# EAGLE design BLE -- HM-10 -- Breakout v0.9.9 (EAGLE 6.5.0)
HM-10 Breakout
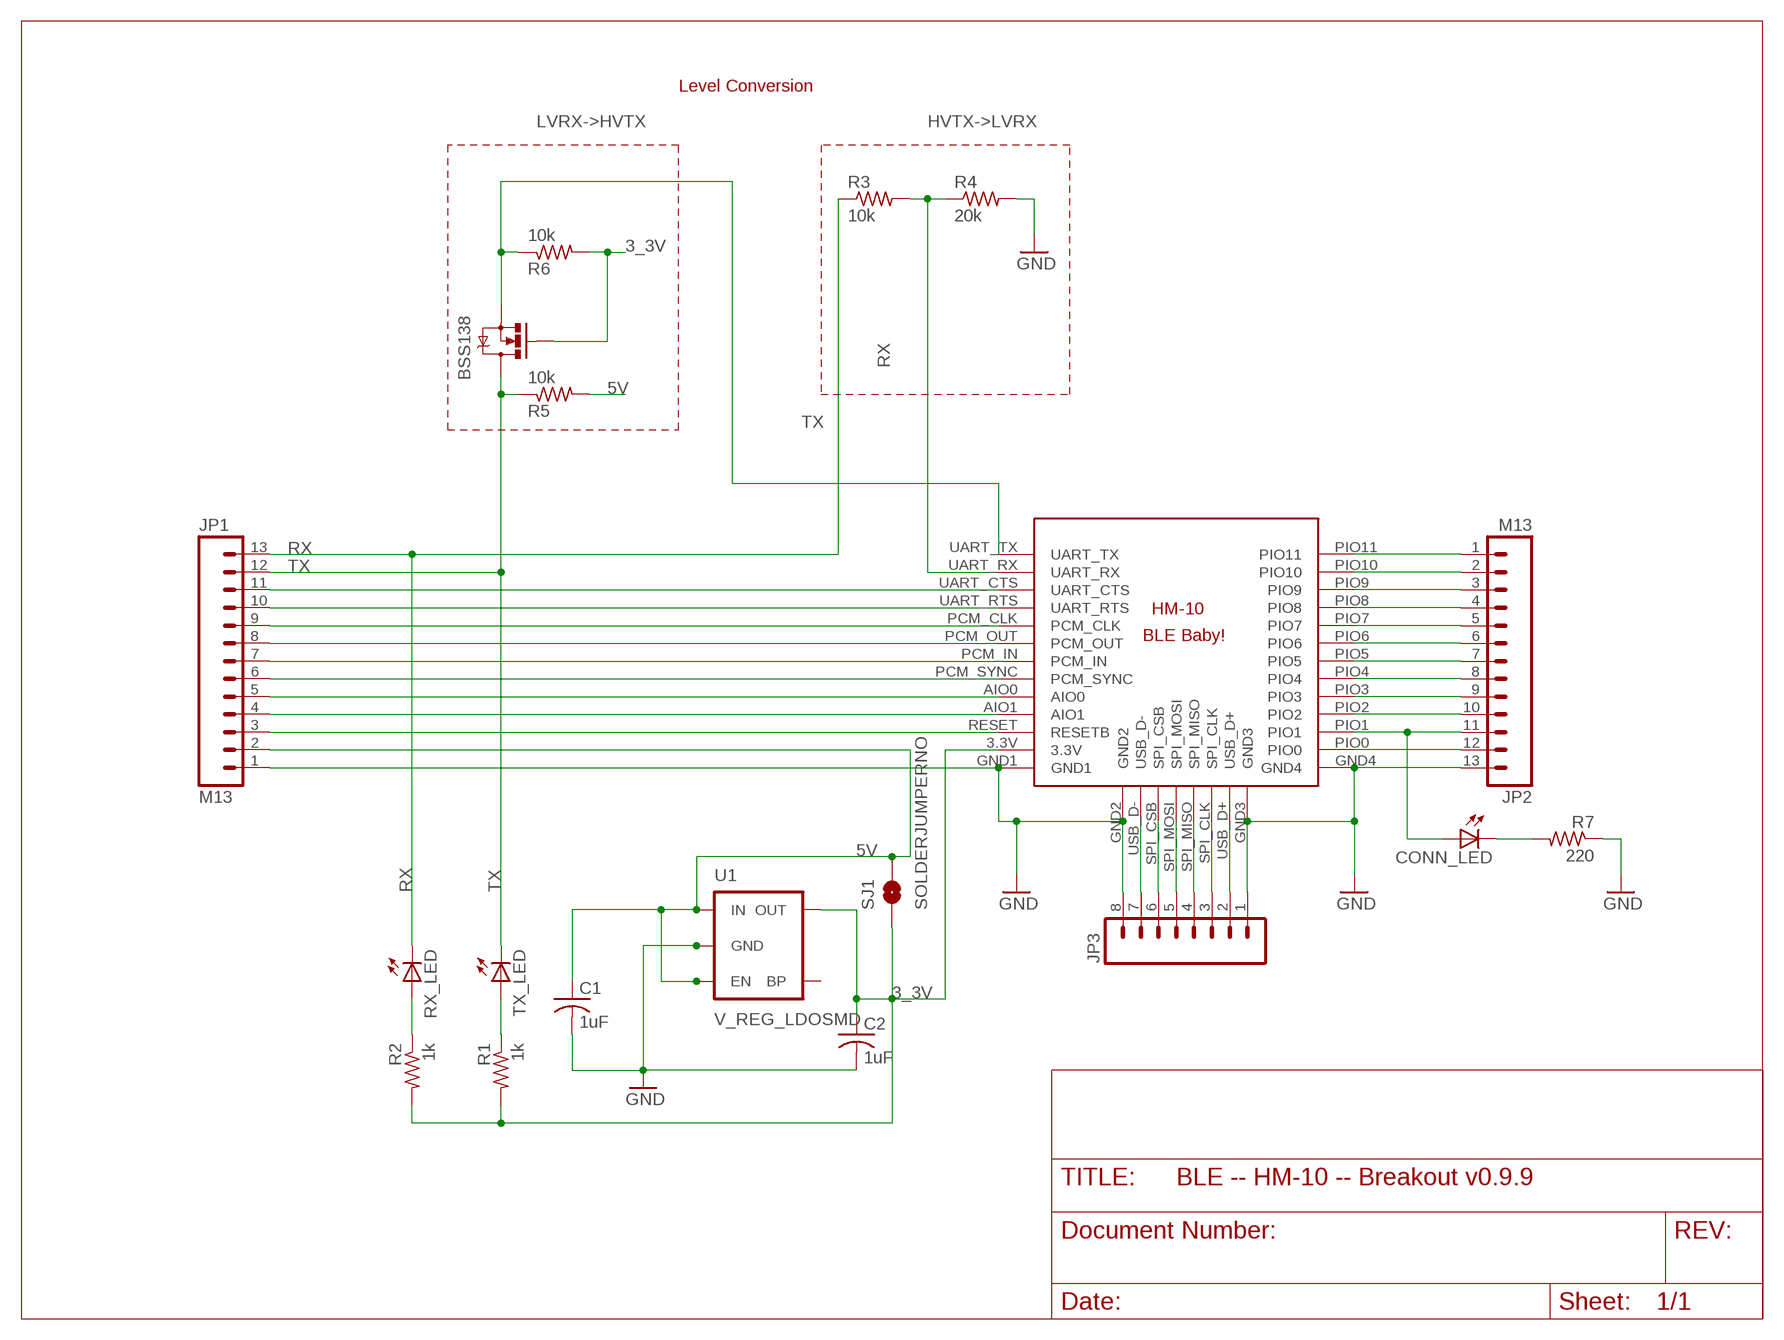
[diagram p0: schematic, sheet 1]

## Parts
BSS138  MOSFET-NCHANNELSMD  [SOT23-3]
C1  1uF  C-USC0805K  [C0805K]
C2  1uF  C-USC0805K  [C0805K]
CONN_LED  LED0603  [LED-0603]
JP1  M13  [1X13]
JP2  M13  [1X13]
JP3  M081X08  [1X08]
R1  1k  R-US_M0805  [M0805]
R2  1k  R-US_M0805  [M0805]
R3  10k  R-US_M0805  [M0805]
R4  20k  R-US_M0805  [M0805]
R5  10k  R-US_M0805  [M0805]
R6  10k  R-US_M0805  [M0805]
R7  220  R-US_M0805  [M0805]
RX_LED  LED0603  [LED-0603]
SJ1  SOLDERJUMPERNO  [SJ_2S-NO]
TX_LED  LED0603  [LED-0603]
U1  V_REG_LDOSMD  [SOT23-5]
U$1  BLE-HM-10  [BLE-HM-10]

## Nets
3_3V: BSS138.1(G) C2.1 R1.2 R2.2 R6.2 SJ1.1 U1.5(OUT) U$1.3.3V
5V: C1.1 JP1.2 R5.2 SJ1.2 U1.1(IN) U1.3(EN)
GND: C1.2 C2.2 JP1.1 JP2.13 JP3.1 JP3.8 R4.2 R7.1 U1.2(GND) U$1.GND1 U$1.GND2 U$1.GND3 U$1.GND4
HVTX->LVRX: R3.2 R4.1 U$1.UART_RX
LVRX->HVTX: BSS138.2(S) R6.1 U$1.UART_TX
N$2: CONN_LED.A JP2.11 U$1.PIO1
N$3: JP1.3 U$1.RESET(RESETB)
N$4: JP1.4 U$1.AIO1
N$5: JP1.5 U$1.AIO0
N$6: JP1.6 U$1.PCM_SYNC
N$7: JP1.7 U$1.PCM_IN
N$8: JP1.8 U$1.PCM_OUT
N$9: JP1.9 U$1.PCM_CLK
N$10: JP1.10 U$1.UART_RTS
N$11: JP1.11 U$1.UART_CTS
N$14: JP2.1 U$1.PIO11
N$15: JP2.2 U$1.PIO10
N$16: JP2.3 U$1.PIO9
N$17: JP2.4 U$1.PIO8
N$18: JP2.5 U$1.PIO7
N$19: JP2.6 U$1.PIO6
N$20: JP2.7 U$1.PIO5
N$21: JP2.8 U$1.PIO4
N$22: JP2.9 U$1.PIO3
N$23: JP2.10 U$1.PIO2
N$24: R1.1 TX_LED.A
N$25: JP2.12 U$1.PIO0
N$26: CONN_LED.C R7.2
N$27: R2.1 RX_LED.A
N$28: JP3.2 U$1.USB_D+
N$29: JP3.3 U$1.SPI_CLK
N$30: JP3.4 U$1.SPI_MISO
N$31: JP3.5 U$1.SPI_MOSI
N$32: JP3.6 U$1.SPI_CSB
N$33: JP3.7 U$1.USB_D-
RX: JP1.13 R3.1 RX_LED.C
TX: BSS138.3(D) JP1.12 R5.1 TX_LED.C
Unconnected: U1.4(BP)

## Notes on the sheet
- Level Conversion

## Library data of the parts
BSS138 = SparkFun:MOSFET-NCHANNEL
C1 C2 = resistor:C-US: CAPACITOR, American symbol
CONN_LED RX_LED TX_LED = SparkFun:LED: LEDs Standard schematic elements and footprints for 5mm, 3mm, 1206, and 0603 sized LEDs. 5mm - Spark Fun Electronics SKU : COM-00529 (and others)
JP1 JP2 = SparkFun:M13
JP3 = SparkFun:M08: Header 8 Standard 8-pin 0.1" header. Use with straight break away headers (SKU : PRT-00116), right angle break away headers (PRT-00553), swiss pins (PRT-00743), machine pins (PRT-00117), and female headers (PRT-00115).
R1-R7 = resistor:R-US_: RESISTOR, American symbol
SJ1 = SparkFun:SOLDERJUMPER: Solder Jumper Standard SMD solder jumper. Used to automate production. Two varients : Normally Open and Normally Closed are the same, but have different paste layers. NC will have a large amount of paste and should jumper during reflow.
U1 = SparkFun:V_REG_LDO: Voltage Regulator LDO Standard 150mA LDO voltage regulator in SOT-23 layout. Micrel part MIC5205. BP (by-pass) pin is used to lower output noise with 470pF cap.
U$1 = Random parts:BLE-HM-10

## Board
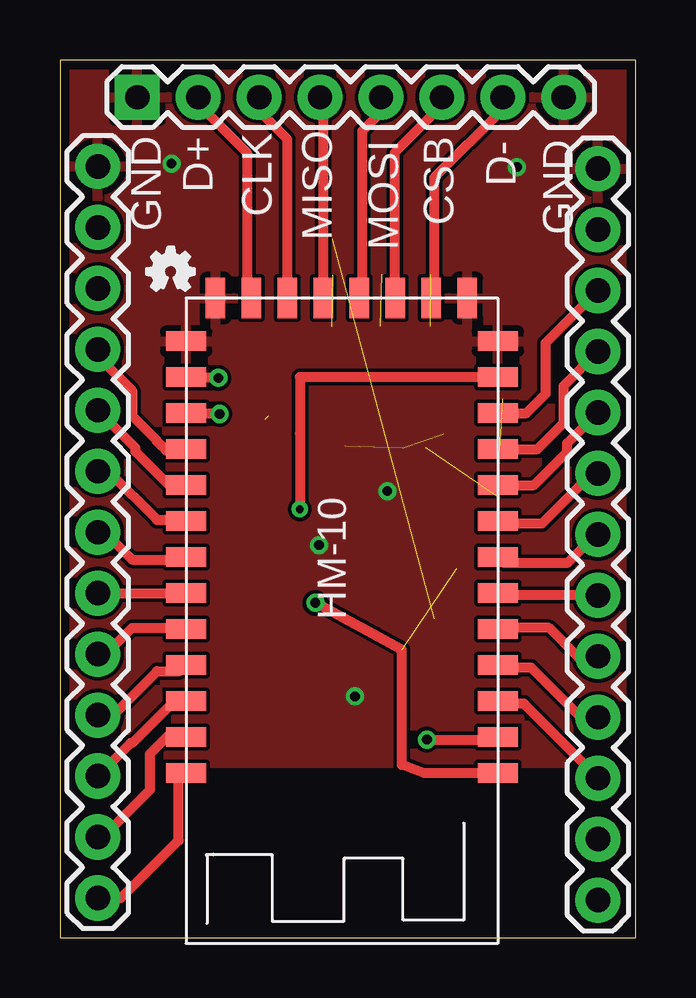
[diagram p1: board, top side]
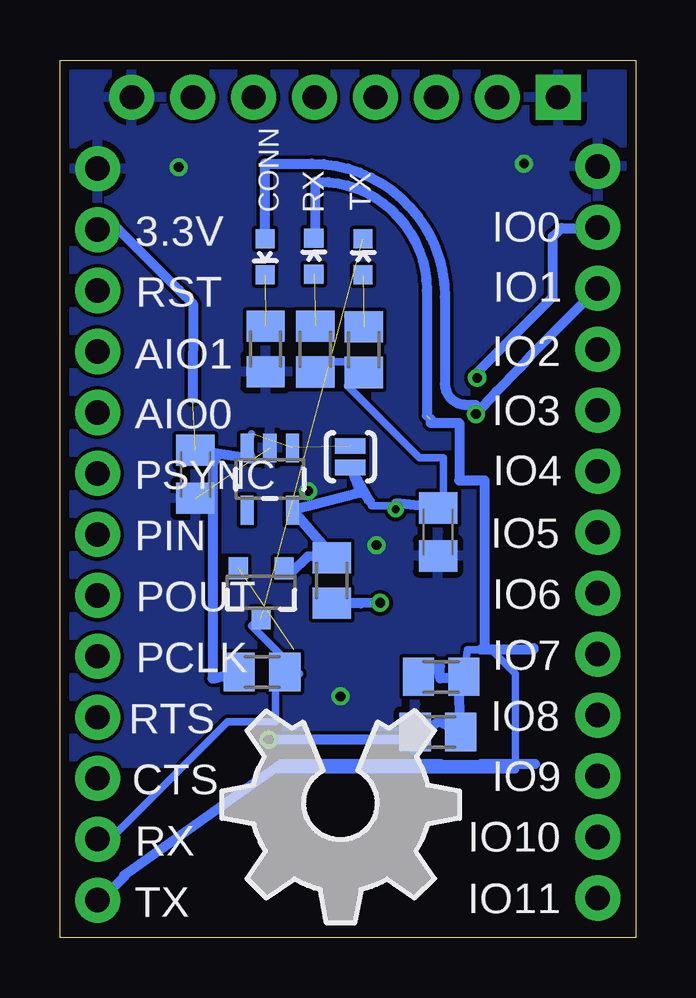
[diagram p2: board, bottom side, seen from below]

Size 24 x 36.57 mm. Coordinates in mm from the lower left corner, seen from the top.
Outline: 0,0 24,0 24,36.57 0,36.57 0,0
Copper layers (1*16): Top 0.0356mm / dielectric 1.5011mm / Bottom 0.0356mm
Design rules "LaenPCBOrder *": minimum track width 12mil, minimum drill 13mil, track to track 6mil, track to pad 6mil, pad to pad 6mil, via to via 6mil, smd to smd 6mil, copper to edge 15mil, drill to drill 6mil, minimum pad ring 7mil, minimum via ring 7mil, stop-mask expansion 4mil, vias tented up to drill 0.4mm, thermal gap 10mil

### Footprints (pad centres in the part's own frame; a part is rotated, then mirrored left to right if it is on the bottom)
SOT23-3 = smd 0.8 x 0.9: 1 -0.95,-1; 2 0.95,-1; 3 0,1.1
C0805K = smd 1.3 x 1.6: 1 -1,0; 2 1,0
LED-0603 = smd 0.8 x 0.8: A 0,-0.75; C 0,0.75
1X13 = drill 1.016 pad 1.88: 1 0,0; 2 2.54,0; 3 5.08,0; 4 7.62,0; 5 10.16,0; 6 12.7,0; 7 15.24,0; 8 17.78,0; 9 20.32,0; 10 22.86,0; 11 25.4,0; 12 27.94,0; 13 30.48,0
1X08 = drill 1.016 pad 1.88 square: 1 0,0 | drill 1.016 pad 1.88: 2 2.54,0; 3 5.08,0; 4 7.62,0; 5 10.16,0; 6 12.7,0; 7 15.24,0; 8 17.78,0
M0805 = smd 1.3 x 1.6: 1 -0.95,0; 2 0.95,0
SJ_2S-NO = smd 0.635 x 1.27: 1 -0.45,0; 2 0.45,0
SOT23-5 = smd 0.55 x 1.2: 1 -0.95,-1.3; 2 0,-1.3; 3 0.95,-1.3; 4 0.95,1.3; 5 -0.95,1.3
BLE-HM-10 = smd 1.676 x 0.813: 3.3V 0,3.29; AIO0 0,7.79; AIO1 0,6.29; GND1 0,1.79; GND4 13,1.79; PCM_CLK 0,13.79; PCM_IN 0,10.79; PCM_OUT 0,12.29; PCM_SYNC 0,9.29; PIO0 13,3.29; PIO1 13,4.79; PIO2 13,6.29; PIO3 13,7.79; PIO4 13,9.29; PIO5 13,10.79; PIO6 13,12.29; PIO7 13,13.79; PIO8 13,15.29; PIO9 13,16.79; PIO10 13,18.29; PIO11 13,19.79; RESET 0,4.79; UART_CTS 0,16.79; UART_RTS 0,15.29; UART_RX 0,18.29; UART_TX 0,19.79 | smd 0.813 x 1.676: GND2 1.27,0; GND3 11.77,0; SPI_CLK 8.77,0; SPI_CSB 4.27,0; SPI_MISO 7.27,0; SPI_MOSI 5.77,0; USB_D+ 10.27,0; USB_D- 2.77,0

### Placement (x,y rotation side)
BSS138  15.61,14.39 180 bottom
C1  18.35,19.3 270 bottom
C2  8.23,16.9 270 bottom
CONN_LED  15.44,28.37 180 bottom
JP1  22.43,32.04 270 top
JP2  1.58,1.65 90 top
JP3  3.22,35.02 0 top
R1  11.33,24.5 270 bottom
R2  13.35,24.52 270 bottom
R3  8.1,10.87 180 bottom
R4  8.24,8.57 180 bottom
R5  15.58,11.07 180 bottom
R6  12.67,14.88 90 bottom
R7  15.43,24.53 90 bottom
RX_LED  13.41,28.39 0 bottom
SJ1  11.89,20.03 90 bottom
TX_LED  11.36,28.37 0 bottom
U1  15.25,19.1 180 bottom
U$1  18.26,26.65 180 top
U$2  [OSHW_FILLX350_NOTEXT]  7.34,9.47 180 bottom
U$3  [OSHW_FILLX70_NOTEXT]  3.62,26.98 0 top

### Tracks (layer width: path | path; a pad name or v marks a point on that pad's centre or on a via)
3_3V  (via drill 0.33)
  Top 0.305: 10,21 10.04,20.98
  Top 0.406: U$1.3.3V 10,23.36 10,21 v10,17.85
  Bottom 0.305: R2.2 13,24 12,24 R1.2 12,23 9,20 8,20 8,18 C2.1 | 9.99,18.09 v10,17.85 10,18 11,18 11.09,18.19
  Bottom 0.406: C2.1 9.99,18.09 | 11.09,18.19 SJ1.1 11.47,18.53 U1.5 12.65,15.9 R6.2 13.66,15.89 14.4,15.15 14.55,15.2 BSS138.1 | R2.2 13.19,23.32
5V  (3 unrouted)
  Bottom 0.305: 16,21 U1.3 | 19,27 19.02,26.98
  Bottom 0.406: JP1.2 21.55,29.5 19.02,26.98 18.45,26.4 18.47,22.46 | U1.3 16.05,19.95 C1.1 17.5,20 17.64,19.72 17.64,10.79 R5.2
GND  (via drill 0.4)  (1 unrouted)
  other vias: 13.65,18.6 19.05,32.1 4.65,32.25 12.3,10.05 10.8,16.35
  pour Bottom: -0.51,7.27 24.64,7.27 24.64,37.34 -0.51,37.34
  pour Top: 0.5,36.5 -0.1,7.28 23.4,7.28 24,36.5
HVTX->LVRX  (via drill 0.4)
  Top 0.406: v15.3,8.25 18.15,8.25 U$1.UART_RX
  Bottom 0.406: v15.3,8.25 9.26,8.25 8.35,8.9 8.2,9.01 R4.1 7.35,9.92 7.35,10.8 8.15,10.8 8.15,11.3 R3.2
LVRX->HVTX  (via drill 0.4)  (1 unrouted)
  Top 0.406: U$1.UART_TX 15.19,6.86 14.25,7.2 14.25,12 v10.65,13.95
  Bottom 0.406: v10.65,13.95 11.45,13.93 R6.1
N$2  (via drill 0.4)
  Top 0.406: U$1.PIO1 6.62,21.86 v6.66,21.82
  Bottom 0.406: JP2.11 4.35,24.28 4.83,23.73 5.81,22.75 v6.66,21.82 6.66,22.2 7.08,22.2 arc90 7.95,23.07 7.95,26.7 arc-90 13.5,32.25 15.45,32.25 CONN_LED.A
N$3
  Top 0.406: U$1.RESET 19.46,21.86 20.25,22.65 20.25,24.78 JP1.3
N$4
  Top 0.406: U$1.AIO1 19.91,20.36 21,21.45 21,22.99 JP1.4
N$5
  Top 0.406: U$1.AIO0 19.76,18.86 21.15,20.25 21.15,20.6 JP1.5
N$6
  Top 0.406: JP1.6 22.19,19.34 20.1,17.25 18.37,17.25 U$1.PCM_SYNC
N$7
  Top 0.406: JP1.7 22.35,16.8 21.15,15.6 18.52,15.6 U$1.PCM_IN
N$8
  Top 0.406: JP1.8 18.36,14.26 U$1.PCM_OUT
N$9
  Top 0.406: JP1.9 21.58,11.72 20.4,12.9 18.3,12.9 U$1.PCM_CLK
N$10
  Top 0.406: JP1.10 21.72,9.18 19.65,11.25 18.37,11.25 U$1.UART_RTS
N$11
  Top 0.406: JP1.11 22.43,6.67 19.35,9.75 18.37,9.75 U$1.UART_CTS
N$14
  Top 0.406: JP2.1 2.55,1.65 4.95,4.05 4.95,6.55 U$1.PIO11
N$15
  Top 0.406: JP2.2 1.79,4.19 3.75,6.15 3.75,7.65 4.5,8.4 5.22,8.4 U$1.PIO10
N$16
  Top 0.406: U$1.PIO9 4.76,9.86 3,8.1 2.95,8.1 JP2.3
N$17
  Top 0.406: JP2.4 2.22,9.27 4.05,11.1 5,11.1 U$1.PIO8
N$18
  Top 0.406: JP2.5 1.91,11.81 3,12.9 5.22,12.9 U$1.PIO7
N$19
  Top 0.406: JP2.6 U$1.PIO6
N$20
  Top 0.406: JP2.7 1.86,16.89 3,15.75 5.15,15.75 U$1.PIO5
N$21
  Top 0.406: JP2.8 2.02,19.43 4.05,17.4 5.22,17.4 U$1.PIO4
N$22
  Top 0.406: U$1.PIO3 4.54,18.86 3.15,20.25 3.15,20.4 JP2.9
N$23
  Top 0.406: JP2.10 1.58,24.22 3,22.8 3,21.75 4.05,20.7 4.05,20.66 4.42,20.3 5.2,20.3 U$1.PIO2
N$24  (1 unrouted)
N$25  (via drill 0.4)
  Top 0.406: U$1.PIO0 6.57,23.36 v6.6,23.32
  Bottom 0.406: JP2.12 1.61,29.56 3.09,29.56 3.45,29.2 3.45,26.7 6.6,23.55 v6.6,23.32
N$26  (1 unrouted)
N$27  (1 unrouted)
N$28
  Top 0.406: JP3.2 5.76,34.73 7.8,32.7 7.8,26.84 U$1.USB_D+
N$29
  Top 0.406: JP3.3 8.3,34.45 9.49,33.26 U$1.SPI_CLK
N$30
  Top 0.406: U$1.SPI_MISO 10.99,34.87 JP3.4
N$31
  Top 0.406: JP3.5 13.38,34.38 12.6,33.6 12.6,26.76 U$1.SPI_MOSI
N$32
  Top 0.406: JP3.6 15.93,34.67 13.95,32.7 13.95,26.69 U$1.SPI_CSB
N$33
  Top 0.406: JP3.7 18.46,34.52 15.6,31.65 15.6,26.76 U$1.USB_D-
RX  (1 unrouted)
  Bottom 0.305: R3.1 7,12 6.45,12 6.3,12 6,12 5,11 5,7 15,7 15.04,7.05
  Bottom 0.406: JP1.13 22.12,1.87 21.98,1.87 21.3,2.55 21.33,2.58 15.04,7.05 14.78,7.23 8.13,7.22 6.45,7.2 6.45,7.24 4.18,7.24 | 4.26,12.07 4.26,12 6.45,12 | RX_LED.C 13.35,29.14 13.35,31.5 13.23,31.5 arc90 8.7,26.96 8.7,21.75 | 8.55,21.6 8.55,21.45 7.35,21.45 7.35,19.05 6.3,19.05 6.3,12
TX  (1 unrouted)
  Bottom 0.305: BSS138.3 16,13 14,11 R5.1 15,11 15,9 17,9 22,4 JP1.12

### Text on the board
tNames: CLK | MISO | GND | D+ | MOSI | CSB | D- | GND | HM-10
bNames: IO0 | TX | RX | CONN | 3.3V | IO1 | RST | IO2 | AIO1 | IO3 | AIO0 | IO4 | PSYNC | IO5 | PIN | IO6 | POUT | IO7 | PCLK | IO8 | RTS | IO9 | CTS | IO10 | RX | IO11 | TX